# Altium schematic sheet Sheet4.SchDoc
size A2
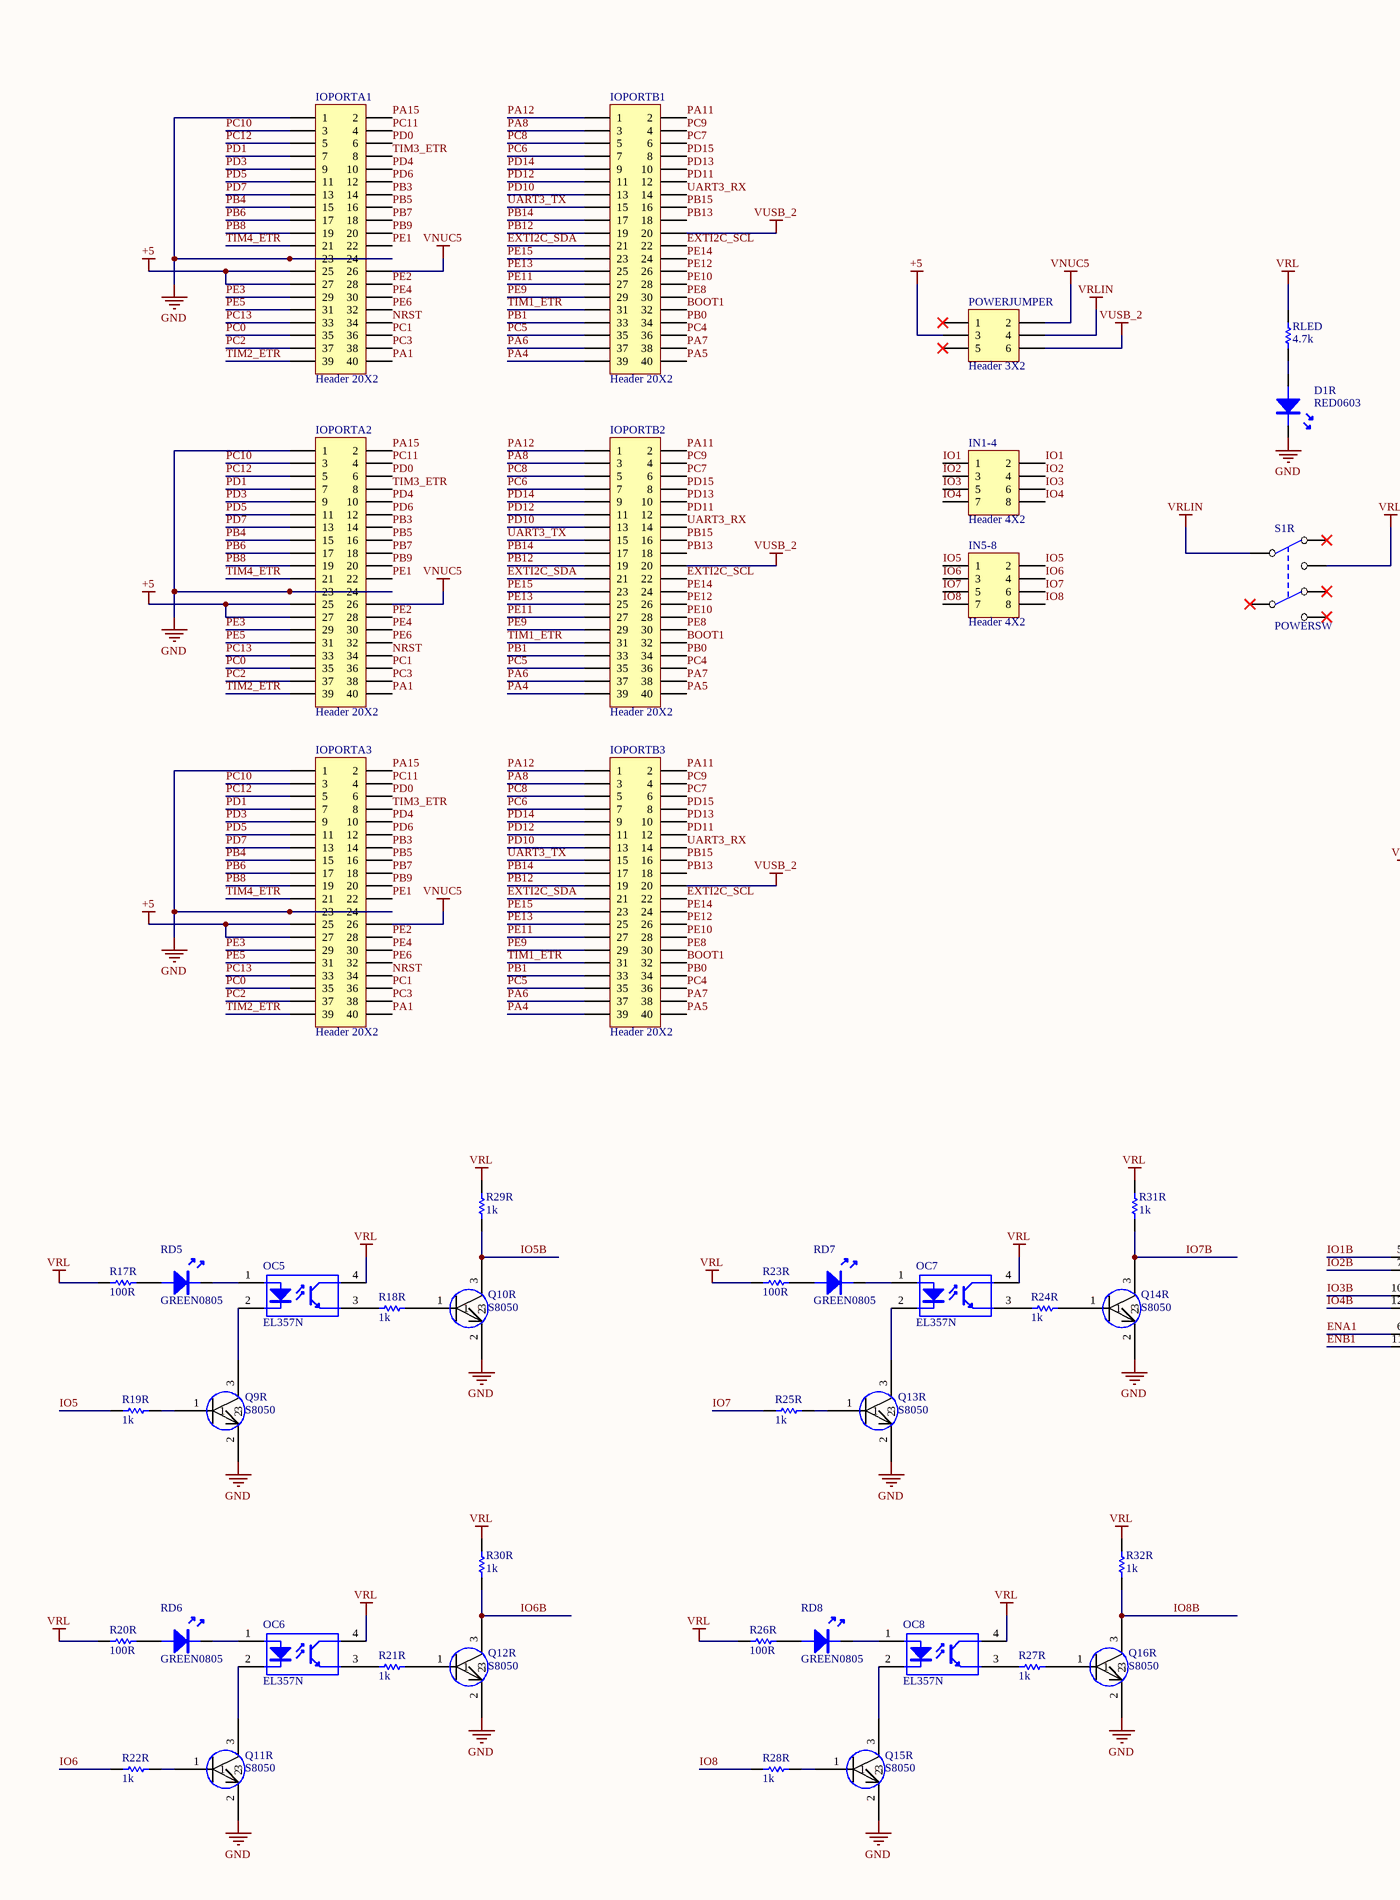
[diagram p0: Sheet4.SchDoc, left]
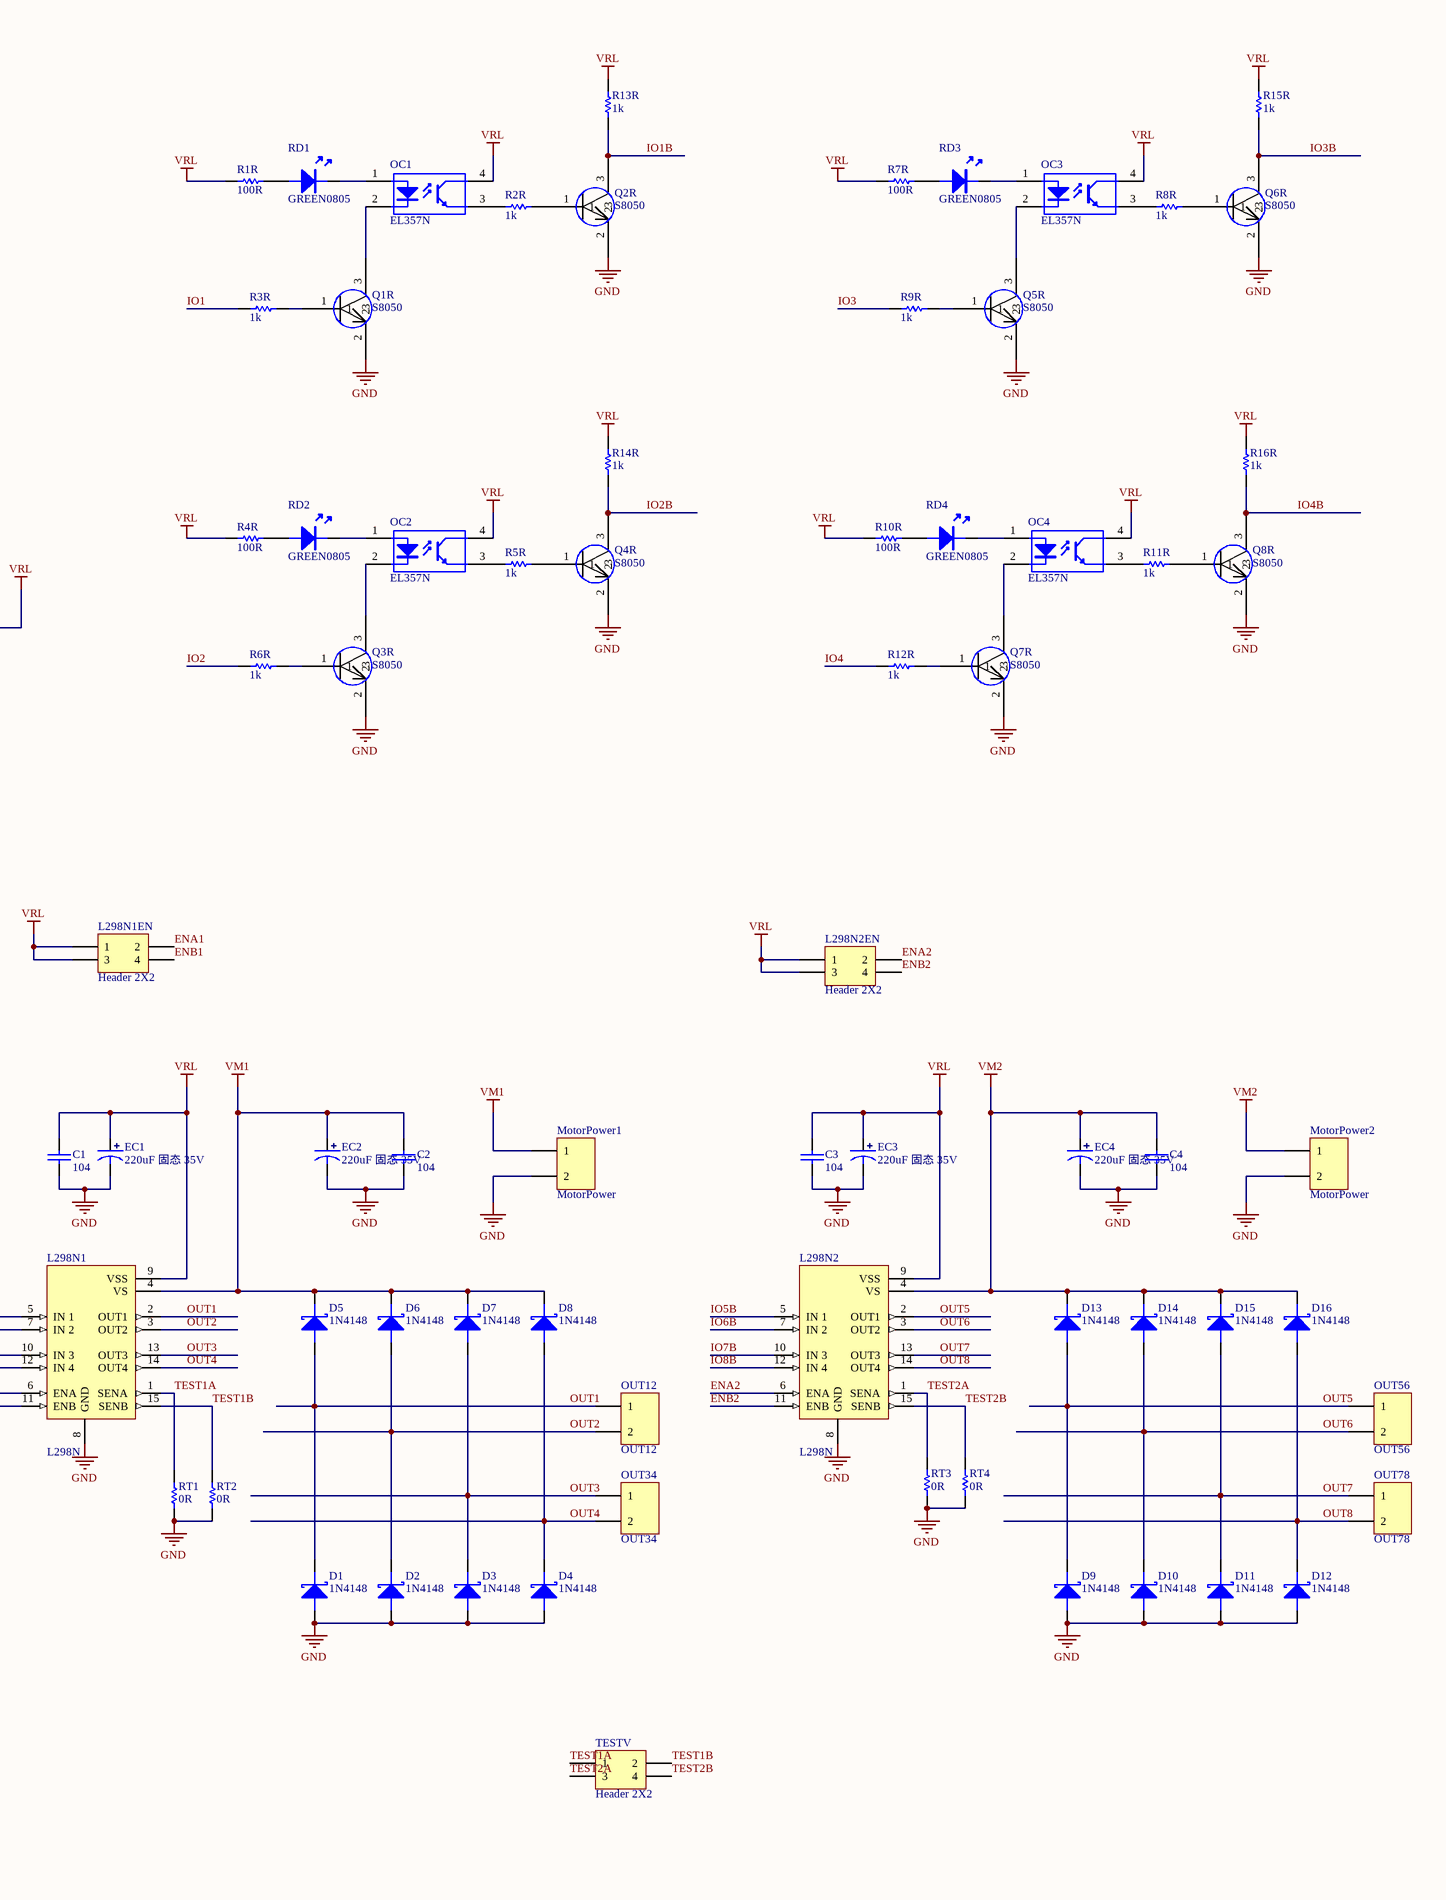
[diagram p1: Sheet4.SchDoc, right]

## Parts
C1  104  [0805C]
C2  104  [0805C]
C3  104  [0805C]
C4  104  [0805C]
D1  1N4148  [SOD-323]
D1R  RED0603  [LED-0603W]
D2  1N4148  [SOD-323]
D3  1N4148  [SOD-323]
D4  1N4148  [SOD-323]
D5  1N4148  [SOD-323]
D6  1N4148  [SOD-323]
D7  1N4148  [SOD-323]
D8  1N4148  [SOD-323]
D9  1N4148  [SOD-323]
D10  1N4148  [SOD-323]
D11  1N4148  [SOD-323]
D12  1N4148  [SOD-323]
D13  1N4148  [SOD-323]
D14  1N4148  [SOD-323]
D15  1N4148  [SOD-323]
D16  1N4148  [SOD-323]
EC1  220uF 固态 35V  [DIP-EC8X12]
EC2  220uF 固态 35V  [DIP-EC8X12]
EC3  220uF 固态 35V  [DIP-EC8X12]
EC4  220uF 固态 35V  [DIP-EC8X12]
IN1-4  Header 4X2  [HDR2X4]
IN5-8  Header 4X2  [HDR2X4]
IOPORTA1  Header 20X2  [HDR2X20]
IOPORTA2  Header 20X2  [HDR2X20]
IOPORTA3  Header 20X2  [HDR2X20]
IOPORTB1  Header 20X2  [HDR2X20]
IOPORTB2  Header 20X2  [HDR2X20]
IOPORTB3  Header 20X2  [HDR2X20]
L298N1  L298N  [L298N散热片]
L298N1EN  Header 2X2  [HDR2X2]
L298N2  L298N  [L298N散热片]
L298N2EN  Header 2X2  [HDR2X2]
MotorPower1  MotorPower  [KF301-2P]
MotorPower2  MotorPower  [KF301-2P]
OC1  EL357N  [SMD_EL357N]
OC2  EL357N  [SMD_EL357N]
OC3  EL357N  [SMD_EL357N]
OC4  EL357N  [SMD_EL357N]
OC5  EL357N  [SMD_EL357N]
OC6  EL357N  [SMD_EL357N]
OC7  EL357N  [SMD_EL357N]
OC8  EL357N  [SMD_EL357N]
OUT12  OUT12  [KF301-2P]
OUT34  OUT34  [KF301-2P]
OUT56  OUT56  [KF301-2P]
OUT78  OUT78  [KF301-2P]
POWERJUMPER  Header 3X2  [HDR2X3]
Q1R  S8050  [SOT23]
Q2R  S8050  [SOT23]
Q3R  S8050  [SOT23]
Q4R  S8050  [SOT23]
Q5R  S8050  [SOT23]
Q6R  S8050  [SOT23]
Q7R  S8050  [SOT23]
Q8R  S8050  [SOT23]
Q9R  S8050  [SOT23]
Q10R  S8050  [SOT23]
Q11R  S8050  [SOT23]
Q12R  S8050  [SOT23]
Q13R  S8050  [SOT23]
Q14R  S8050  [SOT23]
Q15R  S8050  [SOT23]
Q16R  S8050  [SOT23]
R1R  100R  [0603R]
R2R  1k  [0603R]
R3R  1k  [0603R]
R4R  100R  [0603R]
R5R  1k  [0603R]
R6R  1k  [0603R]
R7R  100R  [0603R]
R8R  1k  [0603R]
R9R  1k  [0603R]
R10R  100R  [0603R]
R11R  1k  [0603R]
R12R  1k  [0603R]
R13R  1k  [0603R]
R14R  1k  [0603R]
R15R  1k  [0603R]
R16R  1k  [0603R]
R17R  100R  [0603R]
R18R  1k  [0603R]
R19R  1k  [0603R]
R20R  100R  [0603R]
R21R  1k  [0603R]
R22R  1k  [0603R]
R23R  100R  [0603R]
R24R  1k  [0603R]
R25R  1k  [0603R]
R26R  100R  [0603R]
R27R  1k  [0603R]
R28R  1k  [0603R]
R29R  1k  [0603R]
R30R  1k  [0603R]
R31R  1k  [0603R]
R32R  1k  [0603R]
RD1  GREEN0805  [LED-0805G]
RD2  GREEN0805  [LED-0805G]
RD3  GREEN0805  [LED-0805G]
RD4  GREEN0805  [LED-0805G]
RD5  GREEN0805  [LED-0805G]
RD6  GREEN0805  [LED-0805G]
RD7  GREEN0805  [LED-0805G]
RD8  GREEN0805  [LED-0805G]
RLED  4.7k  [0603R]
RT1  0R  [0603R]
RT2  0R  [0603R]
RT3  0R  [0603R]
RT4  0R  [0603R]
S1R  POWERSW  [KFT DIP-7X7]
TESTV  Header 2X2  [HDR2X2]

## Nets
+5: IOPORTA1.25 IOPORTA1.27 IOPORTA2.25 IOPORTA2.27 IOPORTA3.25 IOPORTA3.27 POWERJUMPER.3
GND: C1.1 C2.1 C3.1 C4.1 D1.A D1R.K D2.A D3.A D4.A D9.A D10.A D11.A D12.A EC1.2 EC2.2 EC3.2 EC4.2 IOPORTA1.1 IOPORTA1.23 IOPORTA1.24 IOPORTA2.1 IOPORTA2.23 IOPORTA2.24 IOPORTA3.1 IOPORTA3.23 IOPORTA3.24 L298N1.8(GND) L298N2.8(GND) MotorPower1.2 MotorPower2.2 Q1R.2 Q2R.2 Q3R.2 Q4R.2 Q5R.2 Q6R.2 Q7R.2 Q8R.2 Q9R.2 Q10R.2 Q11R.2 Q12R.2 Q13R.2 Q14R.2 Q15R.2 Q16R.2 RT1.1 RT2.1 RT3.1 RT4.1
VM1: C2.2 D5.K D6.K D7.K D8.K EC2.1 L298N1.4(VS) MotorPower1.1
VM2: C4.2 D13.K D14.K D15.K D16.K EC4.1 L298N2.4(VS) MotorPower2.1
VNUC5: IOPORTA1.26 IOPORTA2.26 IOPORTA3.26 POWERJUMPER.2
VRL: C1.2 C3.2 EC1.1 EC3.1 L298N1.9(VSS) L298N1EN.1 L298N1EN.3 L298N2.9(VSS) L298N2EN.1 L298N2EN.3 OC1.4(C) OC2.4(C) OC3.4(C) OC4.4(C) OC5.4(C) OC6.4(C) OC7.4(C) OC8.4(C) R1R.1 R4R.1 R7R.1 R10R.1 R13R.2 R14R.2 R15R.2 R16R.2 R17R.1 R20R.1 R23R.1 R26R.1 R29R.2 R30R.2 R31R.2 R32R.2 RLED.2 S1R.1
VRLIN: POWERJUMPER.4 S1R.2
VUSB_2: IOPORTB1.20 IOPORTB2.20 IOPORTB3.20 POWERJUMPER.6
BOOT1: IOPORTB1.32 IOPORTB2.32 IOPORTB3.32
ENA1: L298N1.6(ENA) L298N1EN.2
ENA2: L298N2.6(ENA) L298N2EN.2
ENB1: L298N1.11(ENB) L298N1EN.4
ENB2: L298N2.11(ENB) L298N2EN.4
EXTI2C_SCL: IOPORTB1.22 IOPORTB2.22 IOPORTB3.22
EXTI2C_SDA: IOPORTB1.21 IOPORTB2.21 IOPORTB3.21
IO1: IN1-4.1 IN1-4.2 R3R.1
IO1B: L298N1.5(IN_1) Q2R.3 R13R.1
IO2: IN1-4.3 IN1-4.4 R6R.1
IO2B: L298N1.7(IN_2) Q4R.3 R14R.1
IO3: IN1-4.5 IN1-4.6 R9R.1
IO3B: L298N1.10(IN_3) Q6R.3 R15R.1
IO4: IN1-4.7 IN1-4.8 R12R.1
IO4B: L298N1.12(IN_4) Q8R.3 R16R.1
IO5: IN5-8.1 IN5-8.2 R19R.1
IO5B: L298N2.5(IN_1) Q10R.3 R29R.1
IO6: IN5-8.3 IN5-8.4 R22R.1
IO6B: L298N2.7(IN_2) Q12R.3 R30R.1
IO7: IN5-8.5 IN5-8.6 R25R.1
IO7B: L298N2.10(IN_3) Q14R.3 R31R.1
IO8: IN5-8.7 IN5-8.8 R28R.1
IO8B: L298N2.12(IN_4) Q16R.3 R32R.1
NRST: IOPORTA1.34 IOPORTA2.34 IOPORTA3.34
OUT1: D1.K D5.A L298N1.2(OUT1) OUT12.1
OUT2: D2.K D6.A L298N1.3(OUT2) OUT12.2
OUT3: D3.K D7.A L298N1.13(OUT3) OUT34.1
OUT4: D4.K D8.A L298N1.14(OUT4) OUT34.2
OUT5: D9.K D13.A L298N2.2(OUT1) OUT56.1
OUT6: D10.K D14.A L298N2.3(OUT2) OUT56.2
OUT7: D11.K D15.A L298N2.13(OUT3) OUT78.1
OUT8: D12.K D16.A L298N2.14(OUT4) OUT78.2
PA1: IOPORTA1.40 IOPORTA2.40 IOPORTA3.40
PA4: IOPORTB1.39 IOPORTB2.39 IOPORTB3.39
PA5: IOPORTB1.40 IOPORTB2.40 IOPORTB3.40
PA6: IOPORTB1.37 IOPORTB2.37 IOPORTB3.37
PA7: IOPORTB1.38 IOPORTB2.38 IOPORTB3.38
PA8: IOPORTB1.3 IOPORTB2.3 IOPORTB3.3
PA11: IOPORTB1.2 IOPORTB2.2 IOPORTB3.2
PA12: IOPORTB1.1 IOPORTB2.1 IOPORTB3.1
PA15: IOPORTA1.2 IOPORTA2.2 IOPORTA3.2
PB0: IOPORTB1.34 IOPORTB2.34 IOPORTB3.34
PB1: IOPORTB1.33 IOPORTB2.33 IOPORTB3.33
PB3: IOPORTA1.14 IOPORTA2.14 IOPORTA3.14
PB4: IOPORTA1.15 IOPORTA2.15 IOPORTA3.15
PB5: IOPORTA1.16 IOPORTA2.16 IOPORTA3.16
PB6: IOPORTA1.17 IOPORTA2.17 IOPORTA3.17
PB7: IOPORTA1.18 IOPORTA2.18 IOPORTA3.18
PB8: IOPORTA1.19 IOPORTA2.19 IOPORTA3.19
PB9: IOPORTA1.20 IOPORTA2.20 IOPORTA3.20
PB12: IOPORTB1.19 IOPORTB2.19 IOPORTB3.19
PB13: IOPORTB1.18 IOPORTB2.18 IOPORTB3.18
PB14: IOPORTB1.17 IOPORTB2.17 IOPORTB3.17
PB15: IOPORTB1.16 IOPORTB2.16 IOPORTB3.16
PC0: IOPORTA1.35 IOPORTA2.35 IOPORTA3.35
PC1: IOPORTA1.36 IOPORTA2.36 IOPORTA3.36
PC2: IOPORTA1.37 IOPORTA2.37 IOPORTA3.37
PC3: IOPORTA1.38 IOPORTA2.38 IOPORTA3.38
PC4: IOPORTB1.36 IOPORTB2.36 IOPORTB3.36
PC5: IOPORTB1.35 IOPORTB2.35 IOPORTB3.35
PC6: IOPORTB1.7 IOPORTB2.7 IOPORTB3.7
PC7: IOPORTB1.6 IOPORTB2.6 IOPORTB3.6
PC8: IOPORTB1.5 IOPORTB2.5 IOPORTB3.5
PC9: IOPORTB1.4 IOPORTB2.4 IOPORTB3.4
PC10: IOPORTA1.3 IOPORTA2.3 IOPORTA3.3
PC11: IOPORTA1.4 IOPORTA2.4 IOPORTA3.4
PC12: IOPORTA1.5 IOPORTA2.5 IOPORTA3.5
PC13: IOPORTA1.33 IOPORTA2.33 IOPORTA3.33
PD0: IOPORTA1.6 IOPORTA2.6 IOPORTA3.6
PD1: IOPORTA1.7 IOPORTA2.7 IOPORTA3.7
PD3: IOPORTA1.9 IOPORTA2.9 IOPORTA3.9
PD4: IOPORTA1.10 IOPORTA2.10 IOPORTA3.10
PD5: IOPORTA1.11 IOPORTA2.11 IOPORTA3.11
PD6: IOPORTA1.12 IOPORTA2.12 IOPORTA3.12
PD7: IOPORTA1.13 IOPORTA2.13 IOPORTA3.13
PD10: IOPORTB1.13 IOPORTB2.13 IOPORTB3.13
PD11: IOPORTB1.12 IOPORTB2.12 IOPORTB3.12
PD12: IOPORTB1.11 IOPORTB2.11 IOPORTB3.11
PD13: IOPORTB1.10 IOPORTB2.10 IOPORTB3.10
PD14: IOPORTB1.9 IOPORTB2.9 IOPORTB3.9
PD15: IOPORTB1.8 IOPORTB2.8 IOPORTB3.8
PE1: IOPORTA1.22 IOPORTA2.22 IOPORTA3.22
PE2: IOPORTA1.28 IOPORTA2.28 IOPORTA3.28
PE3: IOPORTA1.29 IOPORTA2.29 IOPORTA3.29
PE4: IOPORTA1.30 IOPORTA2.30 IOPORTA3.30
PE5: IOPORTA1.31 IOPORTA2.31 IOPORTA3.31
PE6: IOPORTA1.32 IOPORTA2.32 IOPORTA3.32
PE8: IOPORTB1.30 IOPORTB2.30 IOPORTB3.30
PE9: IOPORTB1.29 IOPORTB2.29 IOPORTB3.29
PE10: IOPORTB1.28 IOPORTB2.28 IOPORTB3.28
PE11: IOPORTB1.27 IOPORTB2.27 IOPORTB3.27
PE12: IOPORTB1.26 IOPORTB2.26 IOPORTB3.26
PE13: IOPORTB1.25 IOPORTB2.25 IOPORTB3.25
PE14: IOPORTB1.24 IOPORTB2.24 IOPORTB3.24
PE15: IOPORTB1.23 IOPORTB2.23 IOPORTB3.23
TEST1A: L298N1.1(SENA) RT1.2 TESTV.1
TEST1B: L298N1.15(SENB) RT2.2 TESTV.2
TEST2A: L298N2.1(SENA) RT3.2 TESTV.3
TEST2B: L298N2.15(SENB) RT4.2 TESTV.4
TIM1_ETR: IOPORTB1.31 IOPORTB2.31 IOPORTB3.31
TIM2_ETR: IOPORTA1.39 IOPORTA2.39 IOPORTA3.39
TIM3_ETR: IOPORTA1.8 IOPORTA2.8 IOPORTA3.8
TIM4_ETR: IOPORTA1.21 IOPORTA2.21 IOPORTA3.21
UART3_RX: IOPORTB1.14 IOPORTB2.14 IOPORTB3.14
UART3_TX: IOPORTB1.15 IOPORTB2.15 IOPORTB3.15
NetD1R_A: D1R.A RLED.1
NetOC1_1: OC1.1(A) RD1.K
NetOC1_2: OC1.2(K) Q1R.3
NetOC1_3: OC1.3(E) R2R.1
NetOC2_1: OC2.1(A) RD2.K
NetOC2_2: OC2.2(K) Q3R.3
NetOC2_3: OC2.3(E) R5R.1
NetOC3_1: OC3.1(A) RD3.K
NetOC3_2: OC3.2(K) Q5R.3
NetOC3_3: OC3.3(E) R8R.1
NetOC4_1: OC4.1(A) RD4.K
NetOC4_2: OC4.2(K) Q7R.3
NetOC4_3: OC4.3(E) R11R.1
NetOC5_1: OC5.1(A) RD5.K
NetOC5_2: OC5.2(K) Q9R.3
NetOC5_3: OC5.3(E) R18R.1
NetOC6_1: OC6.1(A) RD6.K
NetOC6_2: OC6.2(K) Q11R.3
NetOC6_3: OC6.3(E) R21R.1
NetOC7_1: OC7.1(A) RD7.K
NetOC7_2: OC7.2(K) Q13R.3
NetOC7_3: OC7.3(E) R24R.1
NetOC8_1: OC8.1(A) RD8.K
NetOC8_2: OC8.2(K) Q15R.3
NetOC8_3: OC8.3(E) R27R.1
NetQ1R_1: Q1R.1 R3R.2
NetQ2R_1: Q2R.1 R2R.2
NetQ3R_1: Q3R.1 R6R.2
NetQ4R_1: Q4R.1 R5R.2
NetQ5R_1: Q5R.1 R9R.2
NetQ6R_1: Q6R.1 R8R.2
NetQ7R_1: Q7R.1 R12R.2
NetQ8R_1: Q8R.1 R11R.2
NetQ9R_1: Q9R.1 R19R.2
NetQ10R_1: Q10R.1 R18R.2
NetQ11R_1: Q11R.1 R22R.2
NetQ12R_1: Q12R.1 R21R.2
NetQ13R_1: Q13R.1 R25R.2
NetQ14R_1: Q14R.1 R24R.2
NetQ15R_1: Q15R.1 R28R.2
NetQ16R_1: Q16R.1 R27R.2
NetR1R_2: R1R.2 RD1.A
NetR4R_2: R4R.2 RD2.A
NetR7R_2: R7R.2 RD3.A
NetR10R_2: R10R.2 RD4.A
NetR17R_2: R17R.2 RD5.A
NetR20R_2: R20R.2 RD6.A
NetR23R_2: R23R.2 RD7.A
NetR26R_2: R26R.2 RD8.A

Not connected (* = marked no-connect by the designer): POWERJUMPER 1* 5*; S1R 3* 4* 5* 6*

## Library data of the parts
C1-C4 = CAP: 无极性电容
D1-D16 = DIODE SCHOTTKY: 肖特基二极管
D1R RD1-RD8 = LED
EC1-EC4 = DIP_ECAP: 直插电解电容
IN1-4 IN5-8 = Header 4X2: Header, 4-Pin, Dual row; LatestRevisionDate: 17-Jul-2002; LatestRevisionNote: Re-released for DXP Platform.; Publisher: Altium Limited
IOPORTA1-IOPORTA3 IOPORTB1-IOPORTB3 = Header 20X2: Header, 20-Pin, Dual row; LatestRevisionDate: 17-Jul-2002; LatestRevisionNote: Re-released for DXP Platform.; Publisher: Altium Limited
L298N1 L298N2 = L298N: MOTO DEVICE
L298N1EN L298N2EN TESTV = Header 2X2: Header, 2-Pin, Dual row; LatestRevisionDate: 17-Jul-2002; LatestRevisionNote: Re-released for DXP Platform.; Publisher: Altium Limited
MotorPower1 MotorPower2 OUT12 OUT34 OUT56 OUT78 = Connector-2P
OC1-OC8 = EL357N: 线性光耦
POWERJUMPER = Header 3X2: Header, 3-Pin, Dual row; LatestRevisionDate: 17-Jul-2002; LatestRevisionNote: Re-released for DXP Platform.; Publisher: Altium Limited
Q1R Q2R Q3R Q4R Q5R Q6R Q7R Q8R Q9R Q10R Q11R Q12R Q13R Q14R Q15R Q16R = S9014
R1R R2R R3R R4R R5R R6R R7R R8R R9R R10R R11R R12R R13R R14R R15R R16R R17R R18R R19R R20R R21R R22R R23R R24R R25R R26R R27R R28R R29R R30R R31R R32R RLED RT1-RT4 = RES
S1R = KFT DIP-7X7